# Altium schematic sheet Display_LED_Anode Command.SchDoc: Red LED
size 60 x 33 mm
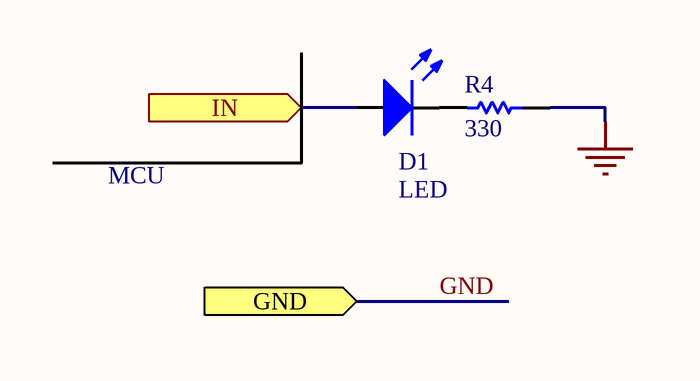
[diagram p0: Display_LED_Anode Command.SchDoc]

## Parts
D1  LED  [LED-5mm_Red]
R4  value 330  [AXIAL-0.4]  (hidden comment: Res1)

## Ports
GND (in), IN (in)

## Nets
GND: R4.1 ; port GND
IN: D1.1(A) ; port IN
NetD1_2: D1.2(K) R4.2

## Notes on the sheet
- MCU
- Sheet Title
- Project Title
- Size:
- Date:
- A4
- Item:
- Time:
- Revision:
- Sheet
- of
- File:

## Library data of the parts
D1 = LED: Typical INFRARED GaAs LED; Manufacturer: Generic Components; Class I: Optoelectronic; Published: 8-Jun-2000; Revision: July-2002: Re-released for DXP Platform.; Publisher: Altium Limited; Class II: LED
R4 = Res1: Resistor; Manufacturer: Generic Components; Class I: Passive; Published: 8-Jun-2000; Revision: July-2002: Re-released for DXP Platform.; Publisher: Altium Limited; Class II: Resistor